# EAGLE design cv-board (EAGLE 7.5.0)
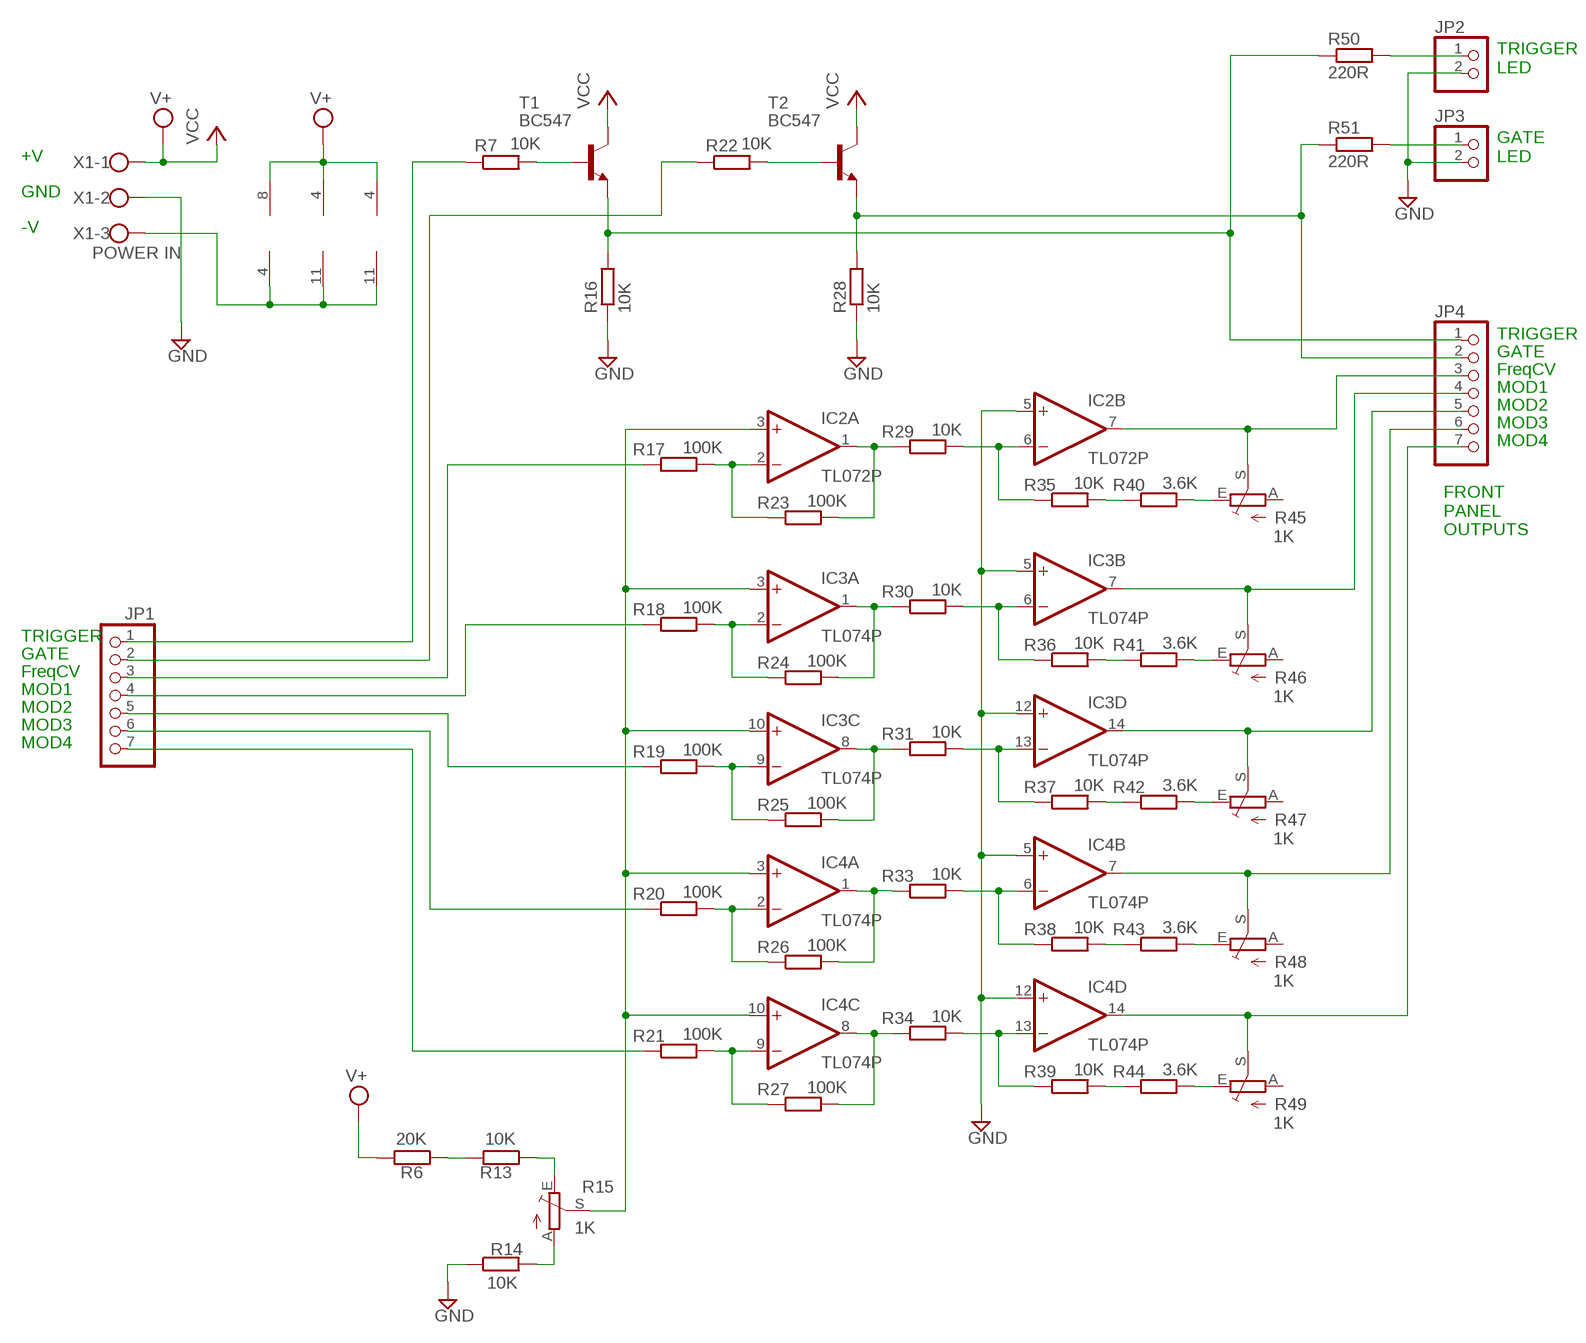
[diagram p0: schematic, sheet 1]

## Parts
IC2  TL072P  [DIL08]
IC3  TL074P  [DIL14]
IC4  TL074P  [DIL14]
JP1  PINHD-1X7  [1X07]
JP2  PINHD-1X2  [1X02]
JP3  PINHD-1X2  [1X02]
JP4  PINHD-1X7  [1X07]
R6  20K  R-EU_0207/7  [0207/7]
R7  10K  R-EU_0207/7  [0207/7]
R13  10K  R-EU_0207/7  [0207/7]
R14  10K  R-EU_0207/7  [0207/7]
R15  1K  TRIM_EU-CA6V  [CA6V]
R16  10K  R-EU_0207/7  [0207/7]
R17  100K  R-EU_0207/7  [0207/7]
R18  100K  R-EU_0207/7  [0207/7]
R19  100K  R-EU_0207/7  [0207/7]
R20  100K  R-EU_0207/7  [0207/7]
R21  100K  R-EU_0207/7  [0207/7]
R22  10K  R-EU_0207/7  [0207/7]
R23  100K  R-EU_0207/7  [0207/7]
R24  100K  R-EU_0207/7  [0207/7]
R25  100K  R-EU_0207/7  [0207/7]
R26  100K  R-EU_0207/7  [0207/7]
R27  100K  R-EU_0207/7  [0207/7]
R28  10K  R-EU_0207/7  [0207/7]
R29  10K  R-EU_0207/7  [0207/7]
R30  10K  R-EU_0207/7  [0207/7]
R31  10K  R-EU_0207/7  [0207/7]
R33  10K  R-EU_0207/7  [0207/7]
R34  10K  R-EU_0207/7  [0207/7]
R35  10K  R-EU_0207/7  [0207/7]
R36  10K  R-EU_0207/7  [0207/7]
R37  10K  R-EU_0207/7  [0207/7]
R38  10K  R-EU_0207/7  [0207/7]
R39  10K  R-EU_0207/7  [0207/7]
R40  3.6K  R-EU_0207/7  [0207/7]
R41  3.6K  R-EU_0207/7  [0207/7]
R42  3.6K  R-EU_0207/7  [0207/7]
R43  3.6K  R-EU_0207/7  [0207/7]
R44  3.6K  R-EU_0207/7  [0207/7]
R45  1K  TRIM_EU-CA6V  [CA6V]
R46  1K  TRIM_EU-CA6V  [CA6V]
R47  1K  TRIM_EU-CA6V  [CA6V]
R48  1K  TRIM_EU-CA6V  [CA6V]
R49  1K  TRIM_EU-CA6V  [CA6V]
R50  220R  R-EU_0207/7  [0207/7]
R51  220R  R-EU_0207/7  [0207/7]
T1  BC547  [TO92]
T2  BC547  [TO92]
X1  POWER IN  W237-103  [W237-103]

## Nets
GND: IC2.5(B:+IN) IC3.5(B:+IN) IC3.12(D:+IN) IC4.5(B:+IN) IC4.12(D:+IN) JP2.2 JP3.2 R14.1 R16.1 R28.1 X1.2
N$1: IC4.6(B:-IN) R33.2 R38.1
N$3: IC4.2(A:-IN) R20.2 R26.1
N$8: IC2.3(A:+IN) IC3.3(A:+IN) IC3.10(C:+IN) IC4.3(A:+IN) IC4.10(C:+IN) R15.S
N$11: JP1.1 R7.1
N$12: JP1.2 R22.1
N$13: JP1.3 R17.1
N$15: JP1.4 R18.1
N$16: JP1.5 R19.1
N$17: JP1.6 R20.1
N$18: JP1.7 R21.1
N$19: R7.2 T1.2(B)
N$20: JP4.1 R16.2 R50.1 T1.1(E)
N$21: R22.2 T2.2(B)
N$22: JP4.2 R28.2 R51.1 T2.1(E)
N$23: IC4.1(A:OUT) R26.2 R33.1
N$27: IC2.2(A:-IN) R17.2 R23.1
N$28: IC3.2(A:-IN) R18.2 R24.1
N$29: IC3.9(C:-IN) R19.2 R25.1
N$30: IC2.8(P:V+) IC3.4(P:V+) IC4.4(P:V+) R6.2 T1.3(C) T2.3(C) X1.1 ; supply symbol labelled VCC, V+
N$32: IC4.9(C:-IN) R21.2 R27.1
N$33: IC2.1(A:OUT) R23.2 R29.1
N$34: IC2.6(B:-IN) R29.2 R35.1
N$35: IC3.1(A:OUT) R24.2 R30.1
N$36: IC3.6(B:-IN) R30.2 R36.1
N$37: IC3.8(C:OUT) R25.2 R31.1
N$38: IC3.13(D:-IN) R31.2 R37.1
N$39: IC4.8(C:OUT) R27.2 R34.1
N$40: IC4.13(D:-IN) R34.2 R39.1
N$41: IC2.4(P:V-) IC3.11(P:V-) IC4.11(P:V-) X1.3
N$42: R14.2 R15.A
N$44: R6.1 R13.2
N$45: R13.1 R15.E
N$53: R35.2 R40.1
N$56: R36.2 R41.1
N$57: R37.2 R42.1
N$59: R38.2 R43.1
N$61: R39.2 R44.1
N$62: R40.2 R45.E
N$63: R41.2 R46.E
N$64: R42.2 R47.E
N$65: R43.2 R48.E
N$66: R44.2 R49.E
N$67: IC2.7(B:OUT) JP4.3 R45.S
N$68: IC3.7(B:OUT) JP4.4 R46.S
N$69: IC3.14(D:OUT) JP4.5 R47.S
N$70: IC4.7(B:OUT) JP4.6 R48.S
N$71: IC4.14(D:OUT) JP4.7 R49.S
N$79: JP2.1 R50.2
N$80: JP3.1 R51.2
Unconnected: R45.A R46.A R47.A R48.A R49.A

## Notes on the sheet
- TRIGGER
  LED
- +V
- GATE
  LED
- GND
- -V
- TRIGGER
- GATE
- FreqCV
- MOD1
- MOD2
- MOD3
- MOD4
- FRONT
  PANEL
  OUTPUTS
- TRIGGER
- GATE
- FreqCV
- MOD1
- MOD2
- MOD3
- MOD4

## Library data of the parts
IC2 = linear:TL072: OP AMP
IC3 IC4 = linear:TL074: OP AMP
JP1 JP4 = pinhead:PINHD-1X7: PIN HEADER
JP2 JP3 = pinhead:PINHD-1X2: PIN HEADER
R6 R7 R13 R14 R16-R31 R33-R44 R50 R51 = rcl:R-EU_: RESISTOR, European symbol
R15 R45-R49 = pot:TRIM_EU-: POTENTIOMETER
T1 T2 = transistor:BC547: NPN TRANSISTOR
X1 = con-wago-500:W237-103: WAGO SCREW CLAMP; MPN: 237-103; OC_FARNELL: unknown; OC_NEWARK: 18M7116

## Board
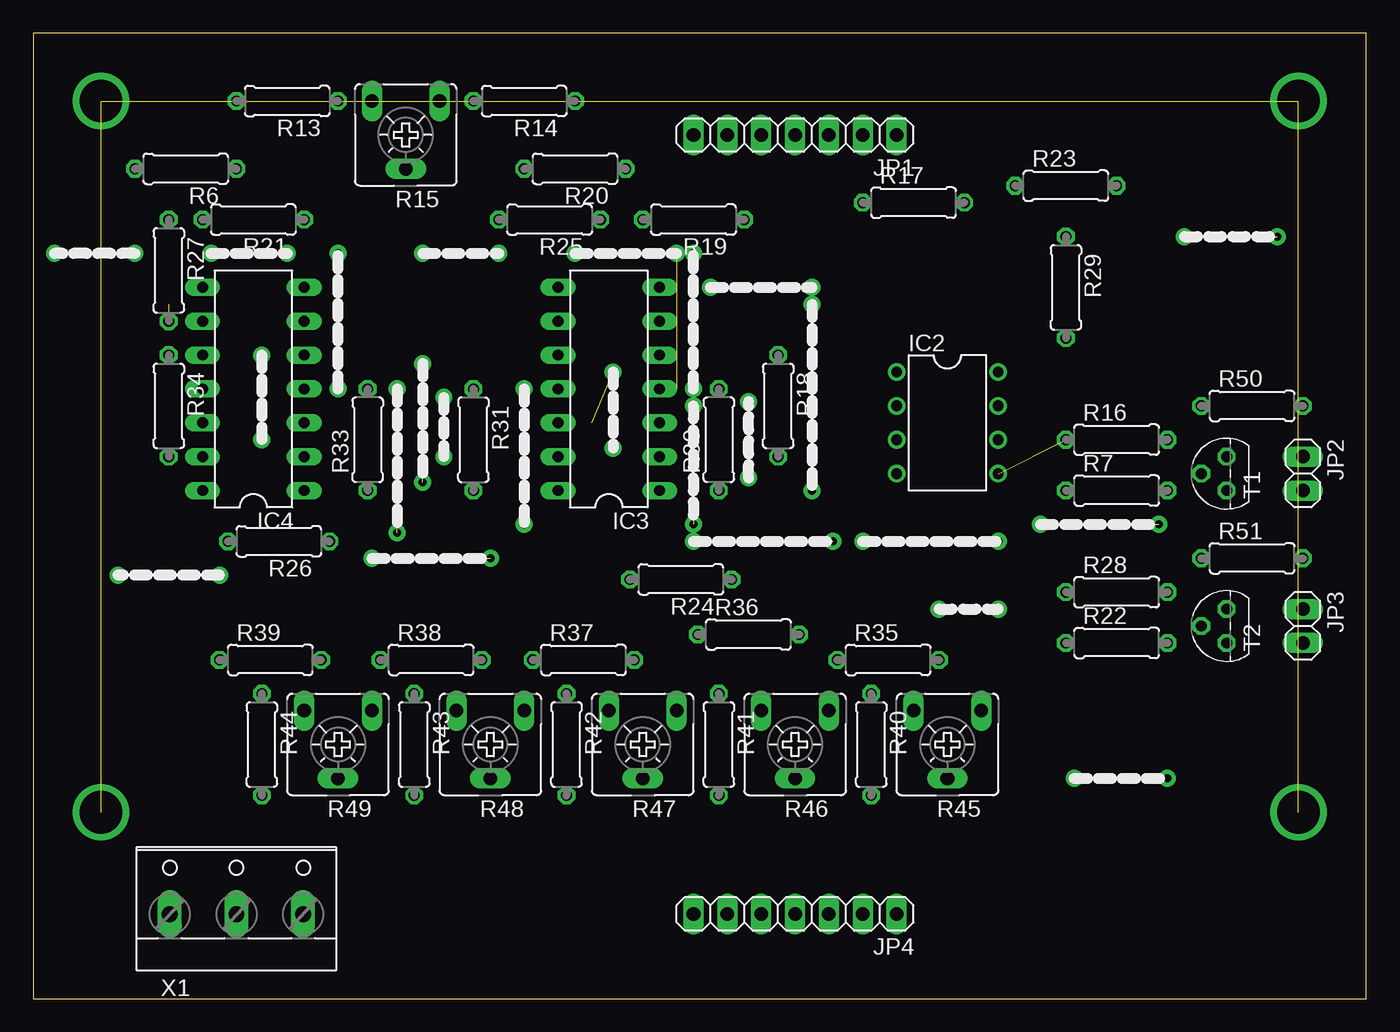
[diagram p1: board, top side]
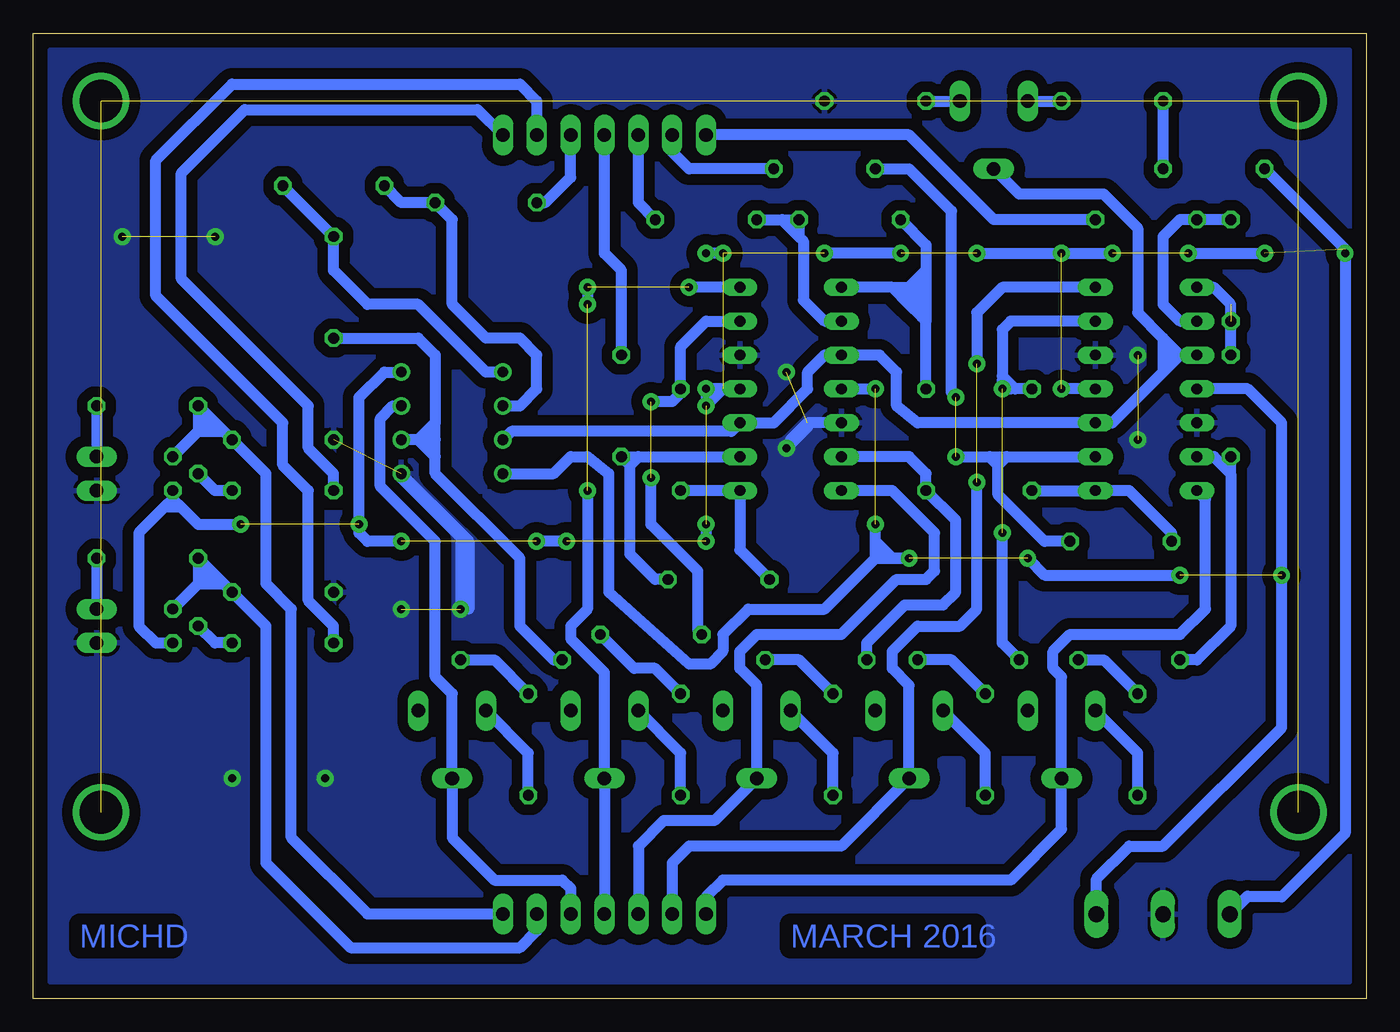
[diagram p2: board, bottom side, seen from below]

Size 100 x 72.39 mm. Coordinates in mm from the lower left corner, seen from the top.
Outline: 0,0 100,0 100,72.39 0,72.39 0,0
Copper layers (1*16): Top 0.035mm / dielectric 1.5mm / Bottom 0.035mm
Design rules "default": minimum track width 10mil, minimum drill 24mil, track to track 8mil, track to pad 8mil, pad to pad 8mil, via to via 8mil, smd to smd 8mil, copper to edge 40mil, drill to drill 8mil, minimum pad ring 10mil, minimum via ring 8mil, stop-mask expansion 4mil, vias tented up to drill 0mil, thermal gap 10mil

### Footprints (pad centres in the part's own frame; a part is rotated, then mirrored left to right if it is on the bottom)
DIL08 = drill 0.813 pad 1.27: 1 -3.81,-3.81; 2 -1.27,-3.81; 3 1.27,-3.81; 4 3.81,-3.81; 5 3.81,3.81; 6 1.27,3.81; 7 -1.27,3.81; 8 -3.81,3.81
DIL14 = drill 0.813 long: 1 -7.62,-3.81; 2 -5.08,-3.81; 3 -2.54,-3.81; 4 0,-3.81; 5 2.54,-3.81; 6 5.08,-3.81; 7 7.62,-3.81; 8 7.62,3.81; 9 5.08,3.81; 10 2.54,3.81; 11 0,3.81; 12 -2.54,3.81; 13 -5.08,3.81; 14 -7.62,3.81
1X07 = drill 1.016 long: 1 -7.62,0; 2 -5.08,0; 3 -2.54,0; 4 0,0; 5 2.54,0; 6 5.08,0; 7 7.62,0
1X02 = drill 1.016 long: 1 -1.27,0; 2 1.27,0
0207/7 = drill 0.813 octagon: 1 -3.81,0; 2 3.81,0
CA6V = drill 1.016 long: A -2.54,-2.54; E 2.54,-2.54; S 0,2.54
TO92 = drill 0.813 octagon: 1 1.27,0; 2 0,1.905; 3 -1.27,0
W237-103 = drill 1.194 long: 1 -5,-1.29; 2 0,-1.29; 3 5,-1.29

### Placement (x,y rotation side)
IC2  68.58,43.18 270 top
IC3  43.18,45.72 90 top
IC4  16.51,45.72 90 top
JP1  57.15,64.77 180 top
JP2  95.25,39.37 270 top
JP3  95.25,27.94 270 top
JP4  57.15,6.35 180 top
R6  11.43,62.23 180 top
R7  81.28,38.1 0 top
R13  19.05,67.31 180 top
R14  36.83,67.31 180 top
R15  27.94,64.77 180 top
R16  81.28,41.91 0 top
R17  66.04,59.69 0 top
R18  55.88,44.45 270 top
R19  49.53,58.42 180 top
R20  40.64,62.23 180 top
R21  16.51,58.42 180 top
R22  81.28,26.67 0 top
R23  77.47,60.96 0 top
R24  48.58,31.43 180 top
R25  38.73,58.42 180 top
R26  18.41,34.29 180 top
R27  10.16,54.61 270 top
R28  81.28,30.48 0 top
R29  77.47,53.34 270 top
R30  51.44,41.91 90 top
R31  33.02,41.91 270 top
R33  25.08,41.91 90 top
R34  10.16,44.45 270 top
R35  64.14,25.4 0 top
R36  53.66,27.3 0 top
R37  41.27,25.4 0 top
R38  29.84,25.4 0 top
R39  17.78,25.4 0 top
R40  62.87,19.05 270 top
R41  51.44,19.05 270 top
R42  40.01,19.05 270 top
R43  28.57,19.05 270 top
R44  17.14,19.05 270 top
R45  68.58,19.05 180 top
R46  57.15,19.05 180 top
R47  45.72,19.05 180 top
R48  34.29,19.05 180 top
R49  22.86,19.05 180 top
R50  91.44,44.45 0 top
R51  91.44,33.02 0 top
T1  89.53,39.37 90 top
T2  89.53,27.94 90 top
X1  15.24,7.62 0 top

### Tracks (layer width: path | path; a pad name or v marks a point on that pad's centre or on a via)
GND  (via drill 0.6 pad 1.27)  (5 unrouted)
  Bottom 0.813: 67.94,34.92 67.94,34.61 | IC3.12 41.91,43.18 | 41.91,43.18 43.18,41.91 43.18,41.59 v43.5,41.27 41.91,42.86 41.91,43.18 | 67.94,34.92 67.31,34.29 67.31,33.02 | v67.94,29.21 67.31,33.02 | 67.94,34.61 67.63,34.29 67.63,33.34 v67.94,29.21 | 67.94,34.61 72.39,39.05 IC2.5 67.94,34.92 | 67.94,34.61 v67.94,29.21 | 67.31,33.02 67.31,29.21
  other vias: 72.39,29.21 86.36,57.15 93.34,57.15 78.11,16.51 85.09,16.51 43.5,46.99 17.14,41.91 17.14,48.26
  pour Bottom (isolate 0.813): 1.27,71.12 1.27,1.27 98.73,1.27 98.73,71.12
N$1  (via drill 0.6 pad 1.27)  (1 unrouted)
  Bottom 0.813: R33.2 26.35,45.72 | 26.35,45.72 26.67,45.72 | 26.67,45.72 v27.3,45.72 27.3,46.35 | IC4.6 26.67,50.8 27.3,50.16 27.3,46.67 | 27.3,46.67 27.3,46.35 | 26.67,45.72 27.3,46.35 | 27.3,46.67 26.35,45.72 | R38.1 27.3,26.67 v27.3,34.92
N$3  (via drill 0.6 pad 1.27)  (1 unrouted)
  Bottom 0.813: v30.8,40.64 28.26,40.64 | 28.26,40.64 26.99,40.64 | 26.99,40.64 IC4.2 | R20.2 34.29,62.23 31.11,59.05 31.11,45.4 30.8,45.09 | R26.1 24.13,34.29 27.62,37.78 27.62,40.01 | 27.62,40.01 28.26,40.64 | 27.62,40.01 26.99,40.64
N$4  (via drill 0.6 pad 1.27)
  other vias: 30.8,45.09
N$6
  pour Bottom (isolate 0.813): 24.13,12.7 26.67,10.16 38.1,10.16 38.1,11.43 34.29,15.24 33.02,15.24 33.02,16.51 31.75,17.78 30.48,17.78 30.48,13.97 27.94,13.97 27.94,17.78 24.13,17.78
N$7  (via drill 0.6 pad 1.27)
  other vias: 29.21,38.73
N$8
  Bottom 0.813: 13.97,48.26 IC4.10 | 13.97,48.26 15.24,46.99 | 15.24,46.99 19.05,43.18 IC4.3 33.66,43.18 35.24,44.45 35.24,46.99 36.51,48.26 IC3.10 40.64,48.26 41.91,46.99 41.91,45.72 44.45,43.18 IC3.3 47.62,42.55 64.14,42.55 IC2.3 | R15.S 26.04,60.33 19.68,60.33 17.14,57.78 17.14,51.44 15.24,49.53 | 13.97,48.26 15.24,49.53 | 15.24,49.53 15.24,48.26 | 15.24,48.26 15.24,46.99 | 15.24,46.99 13.97,48.26 | 13.97,48.26 15.24,48.26
N$9
  pour Bottom (isolate 0.813): 12.7,30.48 24.13,30.48 25.4,31.75 26.67,31.75 26.67,26.67 24.13,26.67 22.86,27.94 13.97,27.94 12.7,29.21
N$10  (via drill 0.6 pad 1.27)
  other vias: 29.21,47.62
N$11
  Bottom 0.813: R7.1 77.47,39.37 79.38,41.27 79.38,44.45 88.9,53.98 88.9,61.91 84.14,66.67 66.67,66.67 JP1.1
N$12
  Bottom 0.813: R22.1 77.47,27.94 79.38,29.84 79.38,38.1 81.28,40.01 81.28,43.18 90.81,52.7 90.81,62.87 85.09,68.58 63.5,68.58 62.23,67.31 JP1.2
N$13
  Bottom 0.813: R17.1 61.59,59.69 59.69,61.59 JP1.3
N$14
  pour Bottom (isolate 0.813): 15.24,33.02 21.59,33.02 21.59,35.56 24.13,35.56 25.4,36.83 17.78,36.83 15.24,34.29
N$15
  Bottom 0.813: R18.1 55.88,54.61 57.15,55.88 JP1.4
N$16
  Bottom 0.813: R19.1 54.61,59.69 JP1.5
N$17
  Bottom 0.813: R20.1 50.8,62.23 52.07,63.5 JP1.6
N$18
  Bottom 0.813: R21.1 27.94,58.42 34.29,64.77 JP1.7
N$19
  Bottom 0.813: R7.2 86.36,38.1 T1.2
N$20
  Bottom 0.813: 85.72,42.55 R50.1 87.63,42.55 | 85.72,42.55 R16.2 82.55,39.37 82.55,31.11 80.64,29.21 80.64,12.06 74.93,6.35 JP4.1 | 87,43.18 87.63,42.55 | 87.63,42.55 T1.1 | 87.63,42.55 85.72,42.55
N$21
  Bottom 0.813: R22.2 86.36,26.67 T2.2
N$22
  Bottom 0.813: 86.68,32.07 R51.1 87.63,31.11 | 86.68,32.07 85.72,31.11 | 85.72,31.11 R28.2 82.55,27.94 82.55,10.16 76.2,3.81 63.5,3.81 62.23,5.08 JP4.2 | T2.1 87.63,31.11 | 87.63,31.11 86.68,32.07 | 87.63,31.11 85.72,31.11
N$23
  Bottom 0.813: R33.1 IC4.1 17.78,38.1 14.61,34.92 R26.2
N$24  (via drill 0.6 pad 1.27)
  other vias: 22.86,45.72
N$25
  pour Bottom (isolate 0.813): 40.64,17.78 43.18,20.32 44.45,20.32 44.45,15.24 46.99,12.7 39.37,12.7 35.56,16.51 35.56,20.32 38.1,20.32 38.1,16.51 39.37,15.24 40.64,15.24
N$26  (via drill 0.6 pad 1.27)
  other vias: 53.66,44.77
N$27
  Bottom 0.813: R23.1 72.39,59.69 R17.2 68.58,58.42 68.58,52.07 66.04,49.53 63.5,49.53 62.23,48.26 62.23,45.72 63.5,44.45 IC2.2
N$28
  Bottom 0.813: 54.61,40.64 R18.2 55.24,40.01 | 54.61,40.64 IC3.2 | 55.24,40.01 55.24,33.34 53.34,31.43 R24.1 | 55.24,40.01 54.61,40.64
N$29
  Bottom 0.813: 42.55,57.15 R25.1 43.81,58.42 | IC3.9 40.64,50.8 42.23,52.39 42.23,56.83 42.55,57.15 | R19.2 43.81,58.42 | 43.81,58.42 42.55,57.15
N$30  (via drill 0.6 pad 1.27)  (10 unrouted)
  Bottom 0.813: 89.53,37.47 90.17,36.83 | 90.17,36.83 92.08,34.92 92.08,27.94 90.81,26.67 T2.3 | 8.89,7.68 X1.1 8.95,7.62 6.35,7.62 1.59,12.38 v1.59,55.88 1.59,56.2 R6.2 | T1.3 89.53,37.47 | 89.53,37.47 88.9,36.83 | 88.9,36.83 87.63,35.56 v84.45,35.56 | 88.9,36.83 90.17,36.83 | IC2.8 73.66,46.99 75.56,45.09 v75.56,35.56 75.56,34.92 74.93,34.29 v72.39,34.29 | IC4.4 22.86,45.72 | v13.34,55.88 v7.62,55.88 | v29.21,55.88 v22.86,55.88 v19.05,55.88 | v34.92,55.88 v40.64,55.88 | IC3.4 48.26,45.72 | 48.26,45.72 v49.53,45.72 v49.53,44.45 48.26,45.72 | v48.26,55.88 v49.53,55.88 | v49.53,35.56 v49.53,34.29 | v60.01,34.29 v62.23,34.29
N$31
  pour Bottom (isolate 0.813): 59.69,39.37 60.96,38.1 64.77,38.1 66.04,39.37 66.04,45.72 68.58,48.26 68.58,39.37 64.77,35.56 59.69,35.56
N$32
  Bottom 0.813: IC4.9 13.97,50.8 15.24,52.07 15.24,57.15 13.97,58.42 R21.2 R27.1
N$33
  Bottom 0.813: IC2.1 66.04,46.99 71.12,52.07 74.93,52.07 77.47,54.61 R29.1 R23.2
N$34
  Bottom 0.813: R35.1 60.96,25.4 63.5,27.94 63.5,33.02 69.85,39.37 69.85,40.64 | R29.2 71.12,49.53 69.85,48.26 69.85,43.18 | 69.85,43.18 71.12,41.91 | 71.12,41.91 IC2.6 | 69.85,40.64 69.85,41.91 | 69.85,41.91 69.85,43.18 | 71.12,41.91 69.85,40.64 | 69.85,40.64 69.85,41.91 | 69.85,41.91 71.12,41.91
N$35
  Bottom 0.813: R30.1 IC3.1 46.99,33.66 R24.2
N$36  (via drill 0.6 pad 1.27)  (1 unrouted)
  Bottom 0.813: IC3.6 49.53,50.8 51.44,48.9 R30.2 51.44,45.4 52.07,44.77 53.66,44.77 | R36.1 50.16,27.62 50.16,32.07 53.66,35.56 v53.66,39.05
N$37
  Bottom 0.813: R31.1 33.02,50.8 | 33.02,50.8 33.34,51.12 | 33.34,51.12 34.29,52.07 | 34.29,52.07 35.56,53.34 | 35.56,53.34 IC3.8 | R25.2 33.02,56.52 33.02,54.61 | 33.02,54.61 33.02,53.34 | 33.02,53.34 33.02,52.07 | 33.02,52.07 33.02,51.44 | 33.02,51.44 33.34,51.12 | 33.02,51.44 33.02,50.8 | 34.29,52.07 33.02,53.34 | 33.02,52.07 34.29,52.07 | 33.02,53.34 34.29,53.34 | 35.56,53.34 34.29,53.34 | 34.29,53.34 33.02,54.61 | 34.29,53.34 34.29,52.07
N$38
  Bottom 0.813: R37.1 37.47,26.67 34.61,29.53 31.75,29.53 30.8,30.48 30.8,35.88 R31.2 33.02,39.37 34.29,40.64 IC3.13
N$39  (1 unrouted)
  Bottom 0.813: R34.1 10.16,52.07 11.43,53.34 IC4.8
N$40
  Bottom 0.813: 10.16,39.37 11.43,40.64 IC4.13 | 10.16,39.37 R34.2 | 10.16,39.37 10.16,27.94 12.7,25.4 R39.1
N$41  (via drill 0.6 pad 1.27)  (3 unrouted)
  Bottom 0.813: IC4.11 8.89,45.72 6.35,43.18 v6.35,31.75 6.35,20.32 15.24,11.43 17.78,11.43 20.24,8.97 X1.3 | IC2.4 60.96,39.37 59.69,40.64 58.42,40.64 56.83,39.37 56.83,30.48 50.8,25.08 49.21,25.08 48.26,26.04 48.26,27.3 46.35,29.21 40.64,29.21 36.83,33.02 | 36.83,33.02 36.83,34.29 | 36.83,34.29 v36.83,35.56 | IC3.11 v36.83,45.72 | 36.83,33.02 v34.29,33.02 35.56,33.02 36.83,34.29 | v25.4,33.02 24.13,31.75 v13.97,31.75
N$42
  Bottom 0.813: R14.2 R15.A
N$43
  pour Bottom (isolate 0.813): 59.69,33.02 62.23,33.02 62.23,27.94 60.96,26.67 60.96,27.94 59.69,29.21
N$44
  Bottom 0.813: R13.2 R6.1
N$45
  Bottom 0.813: R15.E R13.1
N$46
  pour Bottom (isolate 0.813): 64.77,19.05 67.31,19.05 67.31,12.7 64.77,10.16 59.69,10.16 58.42,8.89 58.42,20.32 62.23,20.32 62.23,13.97 63.5,13.97 63.5,17.78
N$47
  pour Bottom (isolate 0.813): 54.61,20.32 52.07,17.78 52.07,13.97 53.34,13.97 54.61,12.7 55.88,12.7 55.88,20.32
N$48
  pour Bottom (isolate 0.813): 50.8,13.97 49.53,13.97 46.99,16.51 46.99,20.32 49.53,20.32 50.8,21.59 52.07,21.59 52.07,20.32 50.8,19.05
N$49
  pour Bottom (isolate 0.813): 35.56,52.07 34.29,50.8 34.29,46.99 35.56,48.26 36.83,49.53 38.1,49.53 38.1,52.07
N$50  (via drill 3.2 pad 4)  (3 unrouted)
  other vias: 5.08,13.97 5.08,67.31 94.92,67.31 94.92,13.97
N$53
  Bottom 0.813: R35.2 65.41,25.4 R40.1
N$56
  Bottom 0.813: R41.1 53.34,24.77 54.93,24.77 R36.2
N$57
  Bottom 0.813: R42.1 42.55,25.4 R37.2
N$59
  Bottom 0.813: R43.1 31.11,25.4 R38.2
N$61
  Bottom 0.813: R39.2 19.68,25.4 R44.1
N$62
  Bottom 0.813: R40.2 62.87,18.41 R45.E
N$63
  Bottom 0.813: R41.2 51.44,18.41 R46.E
N$64
  Bottom 0.813: R42.2 40.01,18.41 R47.E
N$65
  Bottom 0.813: R43.2 28.57,18.41 R48.E
N$66
  Bottom 0.813: R44.2 17.14,18.41 R49.E
N$67
  Bottom 0.813: JP4.3 59.69,8.26 60.33,8.89 65.41,8.89 68.58,12.06 R45.S 68.58,22.86 69.85,24.13 69.85,34.29 73.98,38.42 73.98,43.5 73.03,44.45 IC2.7
N$68  (via drill 0.6 pad 1.27)  (2 unrouted)
  Bottom 0.813: JP4.4 R46.S 57.15,24.45 59.69,26.99 59.69,27.94 58.42,29.21 v58.42,38.1 | IC3.7 v50.8,53.34 | v58.42,53.34 v58.42,52.07
N$69
  Bottom 0.813: JP4.5 54.61,11.43 52.7,13.34 48.9,13.34 R47.S 45.72,23.5 46.99,24.77 46.99,26.04 45.72,27.3 39.37,27.3 35.24,31.43 33.02,31.43 32.38,32.07 32.38,34.92 35.56,38.1 IC3.14
N$70  (1 unrouted)
  Bottom 0.813: JP4.6 52.07,10.16 50.8,11.43 39.37,11.43 R48.S 34.29,23.5 35.56,24.77 35.56,26.04 33.66,27.94 30.48,27.94 29.21,29.21 29.21,38.73 | IC4.7 27.3,53.34 29.21,51.44 29.21,47.62
N$71
  Bottom 0.813: JP4.7 49.53,7.62 48.26,8.89 26.67,8.89 22.86,12.7 R49.S 22.86,24.13 23.5,24.77 23.5,26.04 22.23,27.3 13.97,27.3 12.06,29.21 12.06,37.47 IC4.14
N$79
  Bottom 0.813: R50.2 JP2.1
N$80
  Bottom 0.813: R51.2 JP3.1

### Text on the board
Bottom: MARCH 2016 | MICHD